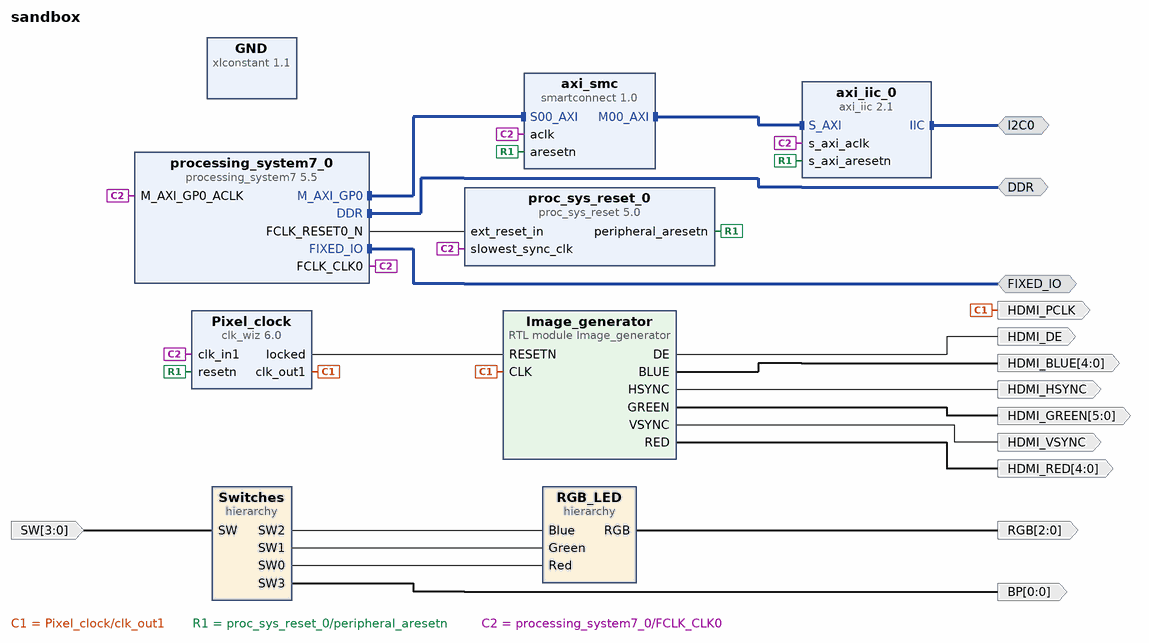
[diagram p0: block diagram of the top level]
# Vivado block design sandbox, xc7z020clg400-1, Vivado 2024.2.1
create_bd_design sandbox

create_bd_intf_port -mode Master -vlnv xilinx.com:interface:ddrx_rtl:1.0 DDR
create_bd_intf_port -mode Master -vlnv xilinx.com:display_processing_system7:fixedio_rtl:1.0 FIXED_IO
create_bd_intf_port -mode Master -vlnv xilinx.com:interface:iic_rtl:1.0 I2C0
create_bd_port -dir O -from 4 -to 0 HDMI_BLUE
create_bd_port -dir O HDMI_DE
create_bd_port -dir O -from 5 -to 0 HDMI_GREEN
create_bd_port -dir O HDMI_HSYNC
create_bd_port -dir O HDMI_PCLK
create_bd_port -dir O -from 4 -to 0 HDMI_RED
create_bd_port -dir O HDMI_VSYNC
create_bd_port -dir O -from 0 -to 0 BP
create_bd_port -dir O -from 2 -to 0 RGB
create_bd_port -dir I -from 3 -to 0 SW

create_bd_cell -type module -reference Image_generator Image_generator
create_bd_cell -type ip -vlnv xilinx.com:ip:clk_wiz:6.0 Pixel_clock
set_property -dict [list \
  CONFIG.CLKOUT1_JITTER 274.704 \
  CONFIG.CLKOUT1_PHASE_ERROR 237.634 \
  CONFIG.CLKOUT1_REQUESTED_OUT_FREQ 31.5 \
  CONFIG.MMCM_CLKFBOUT_MULT_F 39.375 \
  CONFIG.MMCM_CLKOUT0_DIVIDE_F 31.250 \
  CONFIG.MMCM_DIVCLK_DIVIDE 4 \
  CONFIG.RESET_PORT resetn \
  CONFIG.RESET_TYPE ACTIVE_LOW \
  CONFIG.USE_INCLK_STOPPED false \
  CONFIG.USE_LOCKED true \
  CONFIG.USE_POWER_DOWN false \
  CONFIG.USE_RESET true \
] [get_bd_cells Pixel_clock]
create_bd_cell -type ip -vlnv xilinx.com:ip:axi_iic:2.1 axi_iic_0
set_property -dict {CONFIG.IIC_BOARD_INTERFACE i2c0 CONFIG.USE_BOARD_FLOW true} [get_bd_cells axi_iic_0]
create_bd_cell -type ip -vlnv xilinx.com:ip:smartconnect:1.0 axi_smc
set_property -dict {CONFIG.NUM_SI 1} [get_bd_cells axi_smc]
create_bd_cell -type ip -vlnv xilinx.com:ip:proc_sys_reset:5.0 proc_sys_reset_0
create_bd_cell -type ip -vlnv xilinx.com:ip:processing_system7:5.5 processing_system7_0
set_property -dict [list \
  CONFIG.PCW_APU_PERIPHERAL_FREQMHZ 666.666666 \
  CONFIG.PCW_ENET0_PERIPHERAL_CLKSRC {ARM PLL} \
  CONFIG.PCW_ENET0_PERIPHERAL_ENABLE 0 \
  CONFIG.PCW_FPGA0_PERIPHERAL_FREQMHZ 100 \
  CONFIG.PCW_FPGA1_PERIPHERAL_FREQMHZ 50 \
  CONFIG.PCW_GPIO_MIO_GPIO_ENABLE 1 \
  CONFIG.PCW_GPIO_MIO_GPIO_IO MIO \
  CONFIG.PCW_GPIO_PERIPHERAL_ENABLE 1 \
  CONFIG.PCW_I2C_RESET_ENABLE 0 \
  CONFIG.PCW_PRESET_BANK1_VOLTAGE {LVCMOS 1.8V} \
  CONFIG.PCW_QSPI_GRP_FBCLK_ENABLE 1 \
  CONFIG.PCW_QSPI_GRP_FBCLK_IO {MIO 8} \
  CONFIG.PCW_QSPI_GRP_SINGLE_SS_ENABLE 1 \
  CONFIG.PCW_QSPI_GRP_SINGLE_SS_IO {MIO 1 .. 6} \
  CONFIG.PCW_QSPI_PERIPHERAL_ENABLE 1 \
  CONFIG.PCW_QSPI_PERIPHERAL_FREQMHZ 200.000000 \
  CONFIG.PCW_QSPI_QSPI_IO {MIO 1 .. 6} \
  CONFIG.PCW_SD0_GRP_CD_ENABLE 1 \
  CONFIG.PCW_SD0_GRP_CD_IO {MIO 46} \
  CONFIG.PCW_SD0_GRP_WP_ENABLE 1 \
  CONFIG.PCW_SD0_GRP_WP_IO {MIO 47} \
  CONFIG.PCW_SD0_PERIPHERAL_ENABLE 1 \
  CONFIG.PCW_SD0_SD0_IO {MIO 40 .. 45} \
  CONFIG.PCW_SDIO_PERIPHERAL_FREQMHZ 100 \
  CONFIG.PCW_SINGLE_QSPI_DATA_MODE x4 \
  CONFIG.PCW_UART1_PERIPHERAL_ENABLE 1 \
  CONFIG.PCW_UART1_UART1_IO {MIO 48 .. 49} \
  CONFIG.PCW_UART_PERIPHERAL_FREQMHZ 100 \
  CONFIG.PCW_UIPARAM_DDR_PARTNO {MT41J256M16 RE-125} \
  CONFIG.PCW_USB0_PERIPHERAL_ENABLE 0 \
  CONFIG.PCW_USB_RESET_ENABLE 0 \
] [get_bd_cells processing_system7_0]
# 282 more settings of processing_system7_0 are not shown: defaults, MIO pin electricals, DDR timing, and values the tool derives
create_bd_cell -type ip -vlnv xilinx.com:ip:xlconstant:1.1 GND
set_property -dict {CONFIG.CONST_VAL 0} [get_bd_cells GND]
create_bd_cell -type hier RGB_LED
create_bd_cell -type hier Switches

# ---- hierarchy /RGB_LED ----
current_bd_instance /RGB_LED
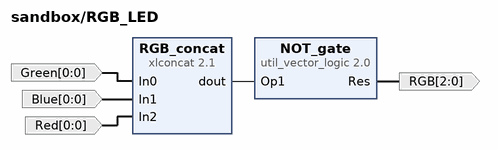
[diagram p1: block diagram inside /RGB_LED]
create_bd_pin -dir O -from 2 -to 0 RGB
create_bd_pin -dir I -from 0 -to 0 Green
create_bd_pin -dir I -from 0 -to 0 Red
create_bd_pin -dir I -from 0 -to 0 Blue

create_bd_cell -type ip -vlnv xilinx.com:ip:xlconcat:2.1 RGB_concat
set_property -dict {CONFIG.NUM_PORTS 3} [get_bd_cells RGB_concat]
create_bd_cell -type ip -vlnv xilinx.com:ip:util_vector_logic:2.0 NOT_gate
set_property -dict {CONFIG.C_OPERATION not CONFIG.C_SIZE 3} [get_bd_cells NOT_gate]

# ---- hierarchy /Switches ----
current_bd_instance /Switches
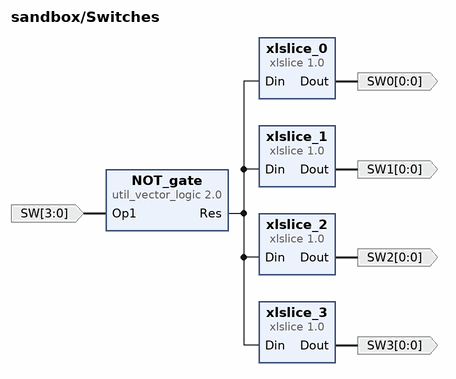
[diagram p2: block diagram inside /Switches]
create_bd_pin -dir I -from 3 -to 0 SW
create_bd_pin -dir O -from 0 -to 0 SW0
create_bd_pin -dir O -from 0 -to 0 SW1
create_bd_pin -dir O -from 0 -to 0 SW2
create_bd_pin -dir O -from 0 -to 0 SW3

create_bd_cell -type ip -vlnv xilinx.com:ip:xlslice:1.0 xlslice_3
set_property -dict {CONFIG.DIN_FROM 0 CONFIG.DIN_TO 0 CONFIG.DIN_WIDTH 4} [get_bd_cells xlslice_3]
create_bd_cell -type ip -vlnv xilinx.com:ip:xlslice:1.0 xlslice_2
set_property -dict {CONFIG.DIN_FROM 1 CONFIG.DIN_TO 1 CONFIG.DIN_WIDTH 4} [get_bd_cells xlslice_2]
create_bd_cell -type ip -vlnv xilinx.com:ip:xlslice:1.0 xlslice_1
set_property -dict {CONFIG.DIN_FROM 2 CONFIG.DIN_TO 2 CONFIG.DIN_WIDTH 4} [get_bd_cells xlslice_1]
create_bd_cell -type ip -vlnv xilinx.com:ip:xlslice:1.0 xlslice_0
set_property -dict {CONFIG.DIN_FROM 3 CONFIG.DIN_TO 3 CONFIG.DIN_WIDTH 4} [get_bd_cells xlslice_0]
create_bd_cell -type ip -vlnv xilinx.com:ip:util_vector_logic:2.0 NOT_gate
set_property -dict {CONFIG.C_OPERATION not CONFIG.C_SIZE 4} [get_bd_cells NOT_gate]

# ---- connections ----

current_bd_instance /RGB_LED
connect_bd_net -net In0_1 [get_bd_pins Green] [get_bd_pins RGB_concat/In0]
connect_bd_net -net In1_1 [get_bd_pins Blue] [get_bd_pins RGB_concat/In1]
connect_bd_net -net In2_1 [get_bd_pins Red] [get_bd_pins RGB_concat/In2]
connect_bd_net -net concatenation_dout [get_bd_pins RGB_concat/dout] [get_bd_pins NOT_gate/Op1]
connect_bd_net -net util_vector_logic_0_Res [get_bd_pins NOT_gate/Res] [get_bd_pins RGB]

current_bd_instance /Switches
connect_bd_net [get_bd_pins NOT_gate/Res] \
  [get_bd_pins xlslice_3/Din] [get_bd_pins xlslice_2/Din] [get_bd_pins xlslice_1/Din] [get_bd_pins xlslice_0/Din]
connect_bd_net [get_bd_pins SW] [get_bd_pins NOT_gate/Op1]
connect_bd_net [get_bd_pins xlslice_0/Dout] [get_bd_pins SW0]
connect_bd_net [get_bd_pins xlslice_1/Dout] [get_bd_pins SW1]
connect_bd_net [get_bd_pins xlslice_2/Dout] [get_bd_pins SW2]
connect_bd_net [get_bd_pins xlslice_3/Dout] [get_bd_pins SW3]

current_bd_instance /
connect_bd_intf_net [get_bd_intf_ports I2C0] [get_bd_intf_pins axi_iic_0/IIC]
connect_bd_intf_net [get_bd_intf_pins axi_smc/M00_AXI] [get_bd_intf_pins axi_iic_0/S_AXI]
connect_bd_intf_net [get_bd_intf_ports DDR] [get_bd_intf_pins processing_system7_0/DDR]
connect_bd_intf_net [get_bd_intf_ports FIXED_IO] [get_bd_intf_pins processing_system7_0/FIXED_IO]
connect_bd_intf_net [get_bd_intf_pins processing_system7_0/M_AXI_GP0] [get_bd_intf_pins axi_smc/S00_AXI]
connect_bd_net -net Blue_1 [get_bd_pins Switches/SW2] [get_bd_pins RGB_LED/Blue]
connect_bd_net -net Green_1 [get_bd_pins Switches/SW1] [get_bd_pins RGB_LED/Green]
connect_bd_net -net Image_generator_0_DE [get_bd_pins Image_generator/DE] [get_bd_ports HDMI_DE]
connect_bd_net -net Image_generator_0_HSYNC [get_bd_pins Image_generator/HSYNC] [get_bd_ports HDMI_HSYNC]
connect_bd_net -net Image_generator_0_VSYNC [get_bd_pins Image_generator/VSYNC] [get_bd_ports HDMI_VSYNC]
connect_bd_net [get_bd_pins Image_generator/BLUE] [get_bd_ports HDMI_BLUE]
connect_bd_net [get_bd_pins Image_generator/GREEN] [get_bd_ports HDMI_GREEN]
connect_bd_net [get_bd_pins Image_generator/RED] [get_bd_ports HDMI_RED]
connect_bd_net [get_bd_pins Pixel_clock/clk_out1] [get_bd_ports HDMI_PCLK] [get_bd_pins Image_generator/CLK]
connect_bd_net [get_bd_pins Pixel_clock/locked] [get_bd_pins Image_generator/RESETN]
connect_bd_net -net RGB_LED_LEDS [get_bd_pins RGB_LED/RGB] [get_bd_ports RGB]
connect_bd_net -net Red_1 [get_bd_pins Switches/SW0] [get_bd_pins RGB_LED/Red]
connect_bd_net [get_bd_ports SW] [get_bd_pins Switches/SW]
connect_bd_net [get_bd_pins Switches/SW3] [get_bd_ports BP]
connect_bd_net [get_bd_pins proc_sys_reset_0/peripheral_aresetn] \
  [get_bd_pins axi_smc/aresetn] [get_bd_pins axi_iic_0/s_axi_aresetn] [get_bd_pins Pixel_clock/resetn]
connect_bd_net [get_bd_pins processing_system7_0/FCLK_CLK0] \
  [get_bd_pins Pixel_clock/clk_in1] [get_bd_pins proc_sys_reset_0/slowest_sync_clk] [get_bd_pins axi_smc/aclk] \
  [get_bd_pins axi_iic_0/s_axi_aclk] [get_bd_pins processing_system7_0/M_AXI_GP0_ACLK]
connect_bd_net [get_bd_pins processing_system7_0/FCLK_RESET0_N] [get_bd_pins proc_sys_reset_0/ext_reset_in]
set_property PFM.CLOCK {FCLK_CLK0 {id "5" is_default "true" proc_sys_reset "/proc_sys_reset_0" status "fixed" freq_hz "100000000"}} [get_bd_cells processing_system7_0]

# ---- address map ----
assign_bd_address -offset 0x41600000 -range 64K -target_address_space [get_bd_addr_spaces processing_system7_0/Data] [get_bd_addr_segs axi_iic_0/S_AXI/Reg]

validate_bd_design
save_bd_design
